# Altium schematic sheet Sheet1.SchDoc
size A2; SheetNumber: 1; SheetTotal: 1
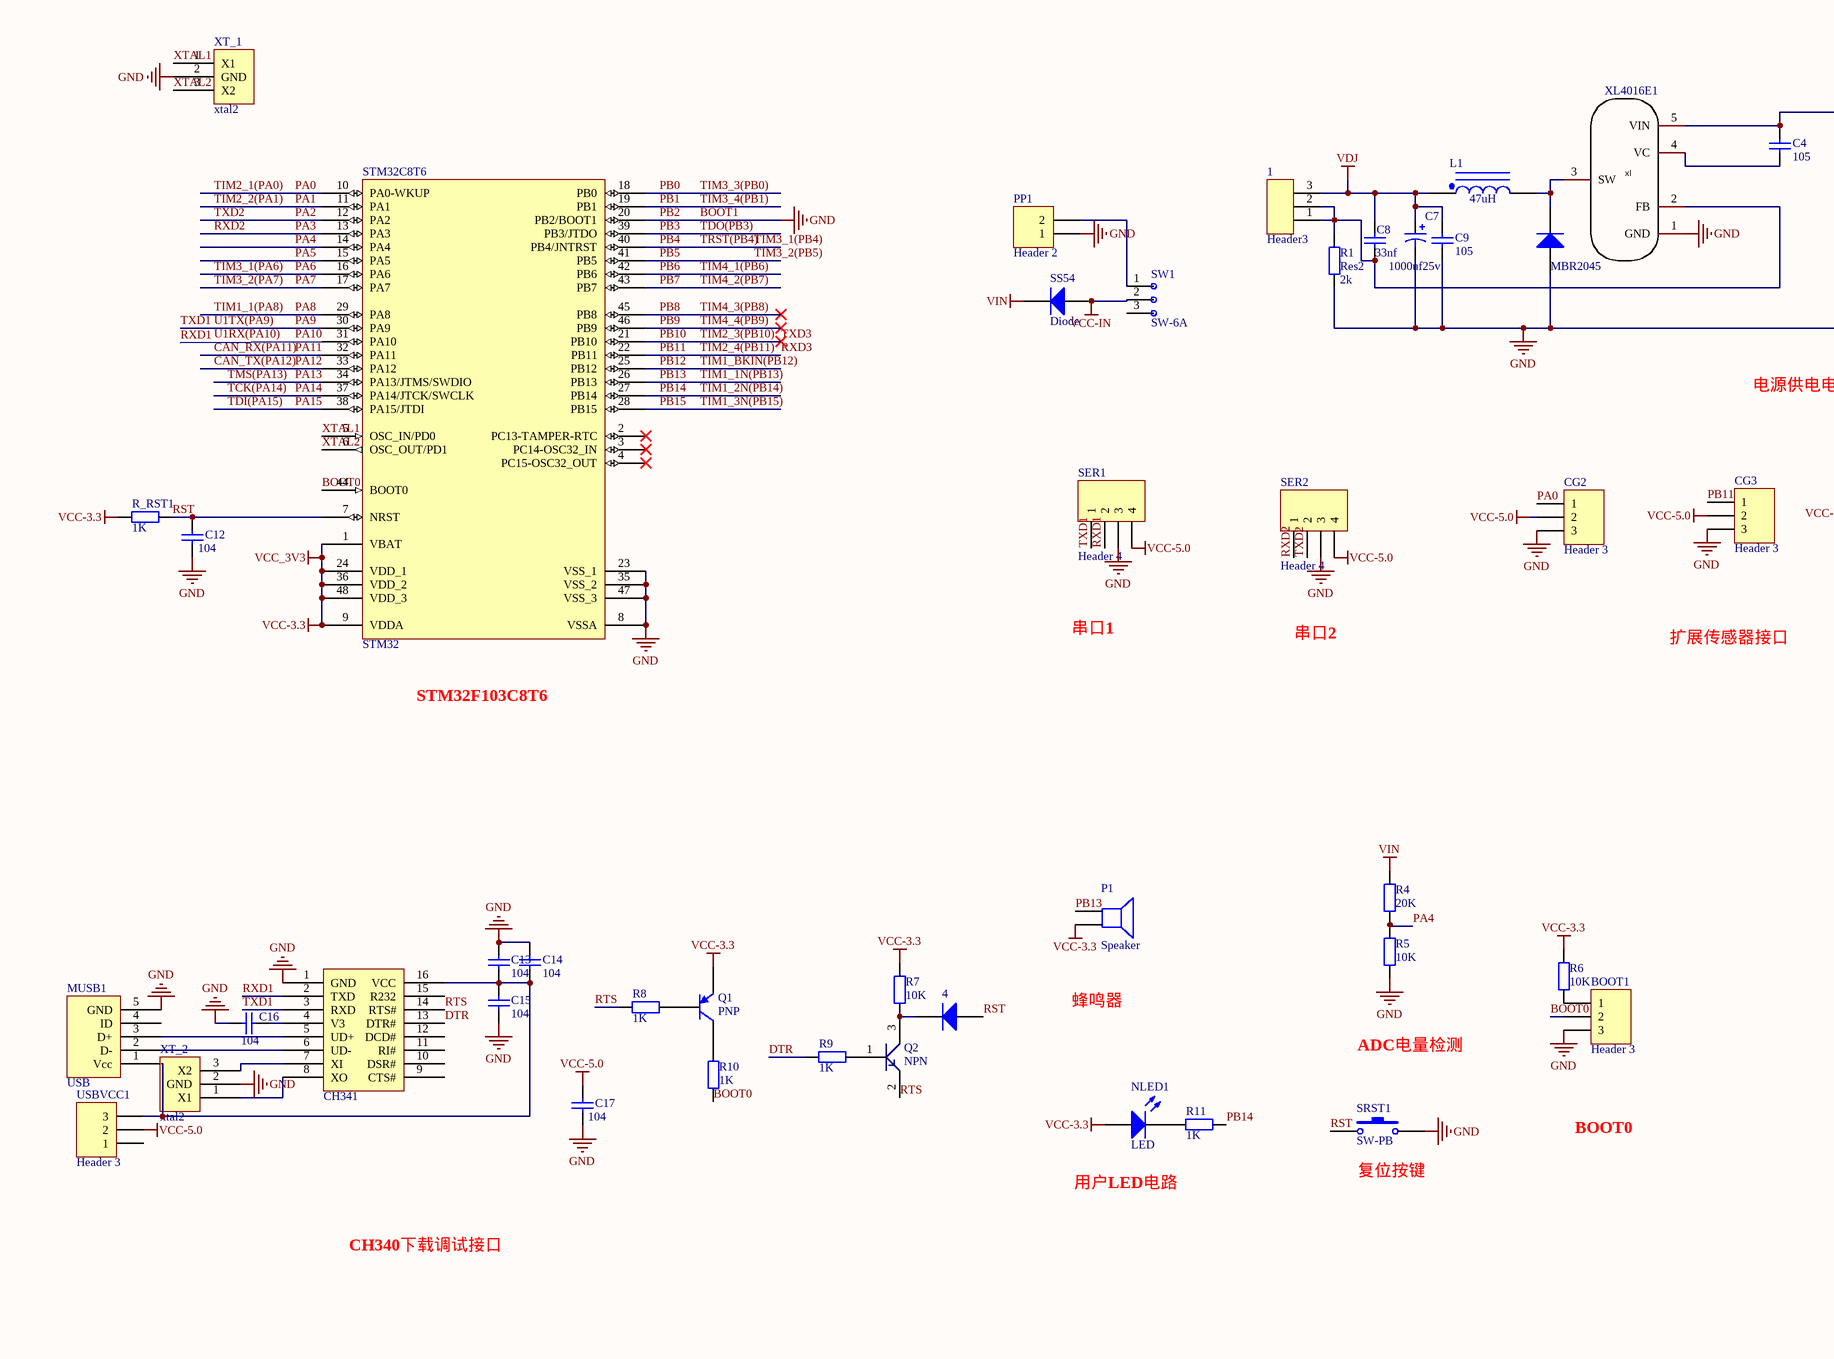
[diagram p0: Sheet1.SchDoc, left]
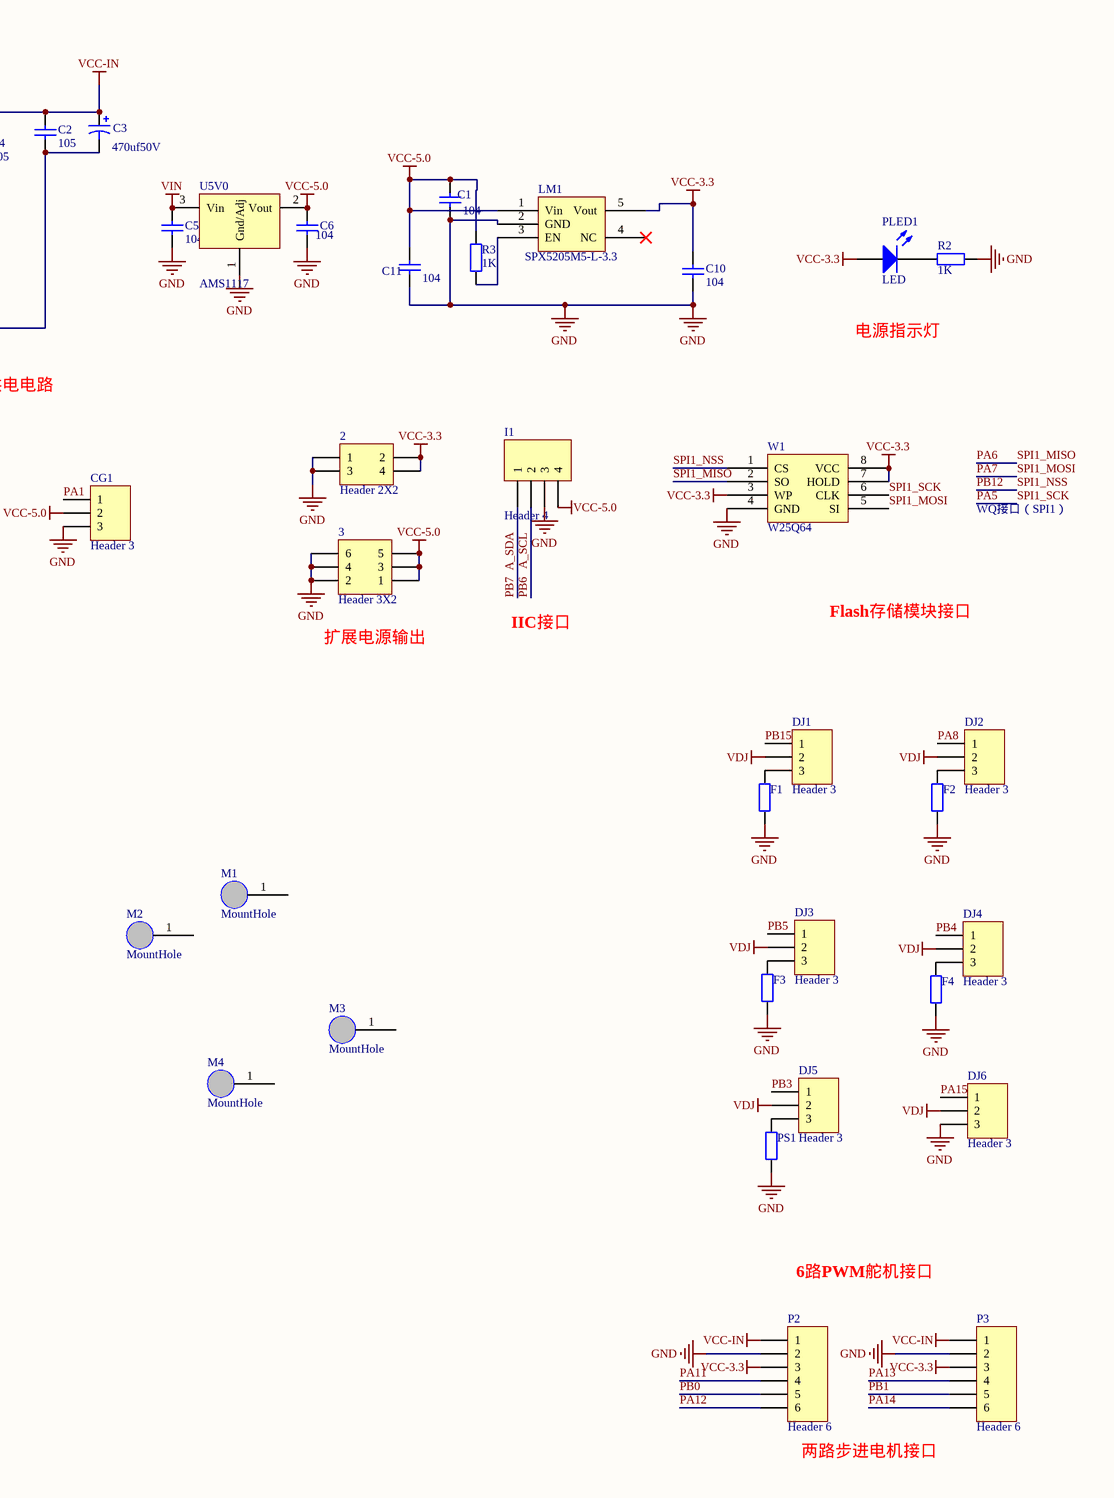
[diagram p1: Sheet1.SchDoc, right]

## Parts
1  Header3  [pot（长方形）]
2  Header 2X2  [HDR2X2]
3  Header 3X2  [HDR2X3]
4  Diode 1N4007  [0805L]  (value not drawn)
BOOT1  Header 3  [HDR1X3]
C1  value 104  [0603C]  (hidden comment: Cap)
C2  value 105  [0603C]  (hidden comment: Cap)
C3  value 470uf50V  [CAP_10_TIE]  (hidden comment: Cap Pol1)
C4  value 105  [0603C]  (hidden comment: Cap)
C5  value 104  [0603C]  (hidden comment: Cap)
C6  value 104  [0603C]  (hidden comment: Cap)
C7  1000uf25v  [cap_6.3_tie]
C8  value 33nf  [0603C]  (hidden comment: Cap)
C9  value 105  [0603C]  (hidden comment: Cap)
C10  value 104  [0603C]  (hidden comment: Cap)
C11  value 104  [0603C]  (hidden comment: Cap)
C12  value 104  [0603C]  (hidden comment: Cap)
C13  value 104  [0603C]  (hidden comment: Cap)
C14  value 104  [0603C]  (hidden comment: Cap)
C15  value 104  [0603C]  (hidden comment: Cap)
C16  value 104  [0603C]  (hidden comment: Cap)
C17  value 104  [0603C]  (hidden comment: Cap)
CG1  Header 3  [HDR1X3]
CG2  Header 3  [HDR1X3]
CG3  Header 3  [HDR1X3]
CH1  CH341  [SOP16]
DJ1  Header 3  [HDR1X3]
DJ2  Header 3  [HDR1X3]
DJ3  Header 3  [HDR1X3]
DJ4  Header 3  [HDR1X3]
DJ5  Header 3  [HDR1X3]
DJ6  Header 3  [HDR1X3]
F1  Res2  [0805R]  (value not drawn)
F2  Res2  [0805R]  (value not drawn)
F3  Res2  [0805R]  (value not drawn)
F4  Res2  [0805R]  (value not drawn)
I1  Header 4  [HDR1X4]
L1  value 47uH  [L_8x15]  (hidden comment: Inductor Iron Dot)
LM1  SPX5205M5-L-3.3  [spx520]
M1  MountHole  [M3-MountSlot]  (no BOM)
M2  MountHole  [M3-MountSlot]  (no BOM)
M3  MountHole  [M3-MountSlot]  (no BOM)
M4  MountHole  [M3-MountSlot]  (no BOM)
MBR2045  Diode 1N4007  [SS54]  (value not drawn)
MUSB1  USB  [microMINIusb 2]
NLED1  LED  [0603L]
P1  Speaker  [beep_9mm]
P2  Header 6  [HDR1X6]
P3  Header 6  [HDR1X6]
PLED1  LED  [0603L]
PP1  Header 2  [接线柱_2]
PS1  Res2  [0805R]  (value not drawn)
Q1  PNP  [sot-23]
Q2  NPN  [sot-23]
R1  Res2  value 2k  [0603R]
R2  value 1K  [0603R]  (hidden comment: Res2)
R3  value 1K  [0603R]  (hidden comment: Res2)
R4  value 20K  [0603R]  (hidden comment: Res2)
R5  value 10K  [0603R]  (hidden comment: Res2)
R6  value 10K  [0603R]  (hidden comment: Res2)
R7  value 10K  [0603R]  (hidden comment: Res2)
R8  value 1K  [0603R]  (hidden comment: Res2)
R9  value 1K  [0603R]  (hidden comment: Res2)
R10  value 1K  [0603R]  (hidden comment: Res2)
R11  value 1K  [0603R]  (hidden comment: Res2)
R_RST1  value 1K  [0603R]  (hidden comment: Res2)
SER1  Header 4  [HDR1X4]
SER2  Header 4  [HDR1X4]
SRST1  SW-PB  [miniBUTTON]
SS54  Diode  [贴片_4007]
STM32C8T6  STM32  [LQFP48]
SW1  SW-6A  [SW-6A]
U5V0  AMS1117  [sot-223]
USBVCC1  Header 3  [HDR1X3]
W1  W25Q64  [sop8 - kuan]
xl  XL4016E1  [PCBComponent_1]
XT_1  xtal2  [XTAL_3213]
XT_2  xtal2  [XTAL_3213]

## Nets
BOOT1: 2.1 2.3 3.2 3.4 3.6 BOOT1.3 C1.1 C2.2 C3.2 C5.1 C6.1 C7.2 C9.2 C10.1 C11.1 C12.1 C13.2 C14.2 C15.2 C16.2 C17.1 CG1.3 CG2.3 CG3.3 CH1.1(GND) DJ6.3 F1.1 F2.1 F3.1 F4.1 I1.3 LM1.2(GND) MBR2045.1(A) MUSB1.5(GND) P2.2 P3.2 PP1.1 PS1.1 R1.2 R2.1 R5.2 SER1.3 SER2.3 SRST1.2 STM32C8T6.8(VSSA) STM32C8T6.20(PB2/BOOT1) STM32C8T6.23(VSS_1) STM32C8T6.35(VSS_2) STM32C8T6.47(VSS_3) U5V0.1(Gnd/Adj) W1.4(GND) xl.1(GND) XT_1.2(GND) XT_2.2(GND)  [also labelled GND, PB2]
VCC-3.3: 2.2 2.4 C10.2 LM1.5(Vout) NLED1.1(A) P1.2 P2.3 P3.3 PLED1.1(A) Q1.2(E) R6.1 R7.1 R_RST1.1 STM32C8T6.1(VBAT) STM32C8T6.9(VDDA) STM32C8T6.24(VDD_1) STM32C8T6.36(VDD_2) STM32C8T6.48(VDD_3) W1.3(WP) W1.7(HOLD) W1.8(VCC)  [also labelled VCC_3V3]
VCC-5.0: 3.1 3.3 3.5 C1.2 C6.2 C11.2 C17.2 CG1.2 CG2.2 CG3.2 I1.4 LM1.1(Vin) R3.1 SER1.4 SER2.4 U5V0.2(Vout) USBVCC1.2
VCC-IN: C2.1 C3.1 C4.1 P2.1 P3.1 SS54.1(A) SW1.2 xl.5(VIN)
VDJ: 1.3 C7.1 C8.1 C9.1 DJ1.2 DJ2.2 DJ3.2 DJ4.2 DJ5.2 DJ6.2 L1.1
VIN: C5.2 R4.1 SS54.2(K) U5V0.3(Vin)
A_SCL: I1.2 STM32C8T6.42(PB6)  [also labelled PB6, TIM4_1(PB6)]
A_SDA: I1.1 STM32C8T6.43(PB7)  [also labelled PB7, TIM4_2(PB7)]
BOOT0: BOOT1.2 R10.1 STM32C8T6.44(BOOT0)
CAN_RX(PA11): P2.4 STM32C8T6.32(PA11)  [also labelled PA11]
CAN_TX(PA12): P2.6 STM32C8T6.33(PA12)  [also labelled PA12]
DTR: CH1.13(DTR#) R9.2
PA0: CG2.1 STM32C8T6.10(PA0-WKUP)  [also labelled TIM2_1(PA0)]
PA1: CG1.1 STM32C8T6.11(PA1)  [also labelled TIM2_2(PA1)]
PA2: SER2.2 STM32C8T6.12(PA2)  [also labelled TXD2]
PA3: SER2.1 STM32C8T6.13(PA3)  [also labelled RXD2]
PA4: R4.2 R5.1 STM32C8T6.14(PA4)
PA5: STM32C8T6.15(PA5) W1.6(CLK)  [also labelled SPI1_SCK]
PA6: STM32C8T6.16(PA6) W1.2(SO)  [also labelled SPI1_MISO, TIM3_1(PA6)]
PA7: STM32C8T6.17(PA7) W1.5(SI)  [also labelled SPI1_MOSI, TIM3_2(PA7)]
PA8: DJ2.1 STM32C8T6.29(PA8)  [also labelled TIM1_1(PA8)]
PA9: CH1.3(RXD) SER1.1 STM32C8T6.30(PA9)  [also labelled TXD1, U1TX(PA9)]
PA13: P3.4 STM32C8T6.34(PA13/JTMS/SWDIO)  [also labelled TMS(PA13)]
PA14: P3.6 STM32C8T6.37(PA14/JTCK/SWCLK)  [also labelled TCK(PA14)]
PA15: DJ6.1 STM32C8T6.38(PA15/JTDI)  [also labelled TDI(PA15)]
PB0: P2.5 STM32C8T6.18(PB0)  [also labelled TIM3_3(PB0)]
PB1: P3.5 STM32C8T6.19(PB1)  [also labelled TIM3_4(PB1)]
PB3: DJ5.1 STM32C8T6.39(PB3/JTDO)  [also labelled TDO(PB3)]
PB4: DJ4.1 STM32C8T6.40(PB4/JNTRST)  [also labelled ~{TRST}(PB4), TIM3_1(PB4)]
PB5: DJ3.1 STM32C8T6.41(PB5)  [also labelled TIM3_2(PB5)]
PB8: STM32C8T6.45(PB8)  [also labelled TIM4_3(PB8)]
PB9: STM32C8T6.46(PB9)  [also labelled TIM4_4(PB9)]
PB10: STM32C8T6.21(PB10)  [also labelled TIM2_3(PB10), TXD3]
PB11: CG3.1 STM32C8T6.22(PB11)  [also labelled RXD3, TIM2_4(PB11)]
PB12: STM32C8T6.25(PB12) W1.1(CS)  [also labelled SPI1_NSS, TIM1_BKIN(PB12)]
PB13: P1.1 STM32C8T6.26(PB13)  [also labelled TIM1_1N(PB13)]
PB14: R11.1 STM32C8T6.27(PB14)  [also labelled TIM1_2N(PB14)]
PB15: DJ1.1 STM32C8T6.28(PB15)  [also labelled TIM1_3N(PB15)]
RST: 4.1(A) C12.2 R_RST1.2 SRST1.1 STM32C8T6.7(NRST)
RTS: CH1.14(RTS#) Q2.2 R8.1
RXD1: CH1.2(TXD) SER1.2 STM32C8T6.31(PA10)
XTAL1: STM32C8T6.5(OSC_IN/PD0) XT_1.1(X1)
XTAL2: STM32C8T6.6(OSC_OUT/PD1) XT_1.3(X2)
Net1_1: 1.1 1.2 C8.2 R1.1 xl.2(FB)
Net4_2: 4.2(K) Q2.3 R7.2
NetBOOT1_1: BOOT1.1 R6.2
NetC4_2: C4.2 xl.4(VC)
NetC13_1: C13.1 C14.1 C15.1 CH1.16(VCC) MUSB1.1(Vcc) USBVCC1.3
NetC16_1: C16.1 CH1.4(V3)
NetCH1_5: CH1.5(UD+) MUSB1.3(D+)
NetCH1_6: CH1.6(UD-) MUSB1.2(D-)
NetCH1_7: CH1.7(XI) XT_2.3(X2)
NetCH1_8: CH1.8(XO) XT_2.1(X1)
NetDJ1_3: DJ1.3 F1.2
NetDJ2_3: DJ2.3 F2.2
NetDJ3_3: DJ3.3 F3.2
NetDJ4_3: DJ4.3 F4.2
NetDJ5_3: DJ5.3 PS1.2
NetL1_2: L1.2 MBR2045.2(K) xl.3(SW)
NetLM1_3: LM1.3(EN) R3.2
NetNLED1_2: NLED1.2(K) R11.2
NetPLED1_2: PLED1.2(K) R2.2
NetPP1_2: PP1.2 SW1.1
NetQ1_1: Q1.1(B) R8.2
NetQ1_3: Q1.3(C) R10.2
NetQ2_1: Q2.1 R9.1

Not connected (* = marked no-connect by the designer): CH1 9(CTS#) 10(DSR#) 11(RI#) 12(DCD#) 15(R232); LM1 4(NC)*; M1 1; M2 1; M3 1; M4 1; MUSB1 4(ID); STM32C8T6 2(PC13-TAMPER-RTC)* 3(PC14-OSC32_IN)* 4(PC15-OSC32_OUT)*; SW1 3; USBVCC1 1

## Notes on the sheet
- 电源指示灯
- 电源供电电路
- WQ接口（SPI1）
- 串口1
- 串口2
- IIC接口
- Flash存储模块接口
- STM32F103C8T6
- 扩展传感器接口
- (near 3) 扩展电源输出
- 蜂鸣器
- ADC电量检测
- (near SRST1) 复位按键
- BOOT0
- 用户LED电路
- CH340下载调试接口
- 6路PWM舵机接口
- (near P2) 两路步进电机接口
- Labels drawn without touching a wire or pin: PA10, U1RX(PA10)

## Library data of the parts
2 = Header 2X2: Header, 2-Pin, Dual row; LatestRevisionDate: 17-Jul-2002; LatestRevisionNote: Re-released for DXP Platform.; Publisher: Altium Limited
3 = Header 3X2: Header, 3-Pin, Dual row; LatestRevisionDate: 17-Jul-2002; LatestRevisionNote: Re-released for DXP Platform.; Publisher: Altium Limited
4 MBR2045 = Diode 1N4007: 1 Amp General Purpose Rectifier; Published: 8-Jun-2000; LatestRevisionDate: 17-Jul-2002; LatestRevisionNote: Re-released for DXP Platform.; DatasheetDocument: 1998; PackageDocument: Aug-1999; PackageReference: DO-41; Publisher: Altium Limited; Code_JEDEC: DO-204-AL; ComponentLink1Description: Manufacturer Link; ComponentLink1URL: http://www.fairchildsemi.com/; ComponentLink2Description: Datasheet; ComponentLink2URL: http://www.fairchildsemi.com/ds/1N%2F1N4001.pdf
BOOT1 CG1-CG3 DJ1-DJ6 USBVCC1 = Header 3: Header, 3-Pin; LatestRevisionDate: 17-Jul-2002; LatestRevisionNote: Re-released for DXP Platform.; Publisher: Altium Limited
C1 C2 C4-C6 C8-C17 = Cap: Capacitor; Published: 8-Jun-2000; LatestRevisionDate: 17-Jul-2002; LatestRevisionNote: Re-released for DXP Platform.; PackageReference: RAD-0.3; Publisher: Altium Limited
C3 = Cap Pol1: Polarized Capacitor (Radial); Published: 8-Jun-2000; LatestRevisionDate: 17-Jul-2002; LatestRevisionNote: Re-released for DXP Platform.; PackageReference: RB7.6-15; Publisher: Altium Limited
C7 = Cap_Pol
F1-F4 PS1 = Res2: Resistor; Value: 1K; Published: 8-Jun-2000; LatestRevisionDate: 17-Jul-2002; LatestRevisionNote: Re-released for DXP Platform.; PackageReference: AXIAL-0.4; Publisher: Altium Limited
I1 SER1 SER2 = Header 4: Header, 4-Pin; LatestRevisionDate: 17-Jul-2002; LatestRevisionNote: Re-released for DXP Platform.; Publisher: Altium Limited
L1 = Inductor Iron Dot: Magnetic-Core Inductor with Winding Polarity Marking; Published: 24-Mar-1999; LatestRevisionDate: 17-Jul-2002; LatestRevisionNote: Re-released for DXP Platform.; PackageReference: DIODE_SMC; Publisher: Altium Limited
LM1 = SPX5205M5-L-5-0
M1-M4 = MountHole: 固定孔
P1 = Speaker: Loudspeaker; Published: 24-Mar-1999; LatestRevisionDate: 17-Jul-2002; LatestRevisionNote: Re-released for DXP Platform.; PackageReference: PIN2; Publisher: Altium Limited
P2 P3 = Header 6: Header, 6-Pin; LatestRevisionDate: 17-Jul-2002; LatestRevisionNote: Re-released for DXP Platform.; Publisher: Altium Limited
PP1 = Header 2: Header, 2-Pin; LatestRevisionDate: 17-Jul-2002; LatestRevisionNote: Re-released for DXP Platform.; Publisher: Altium Limited
R1-R11 R_RST1 = Res2: Resistor; Published: 8-Jun-2000; LatestRevisionDate: 17-Jul-2002; LatestRevisionNote: Re-released for DXP Platform.; PackageReference: AXIAL-0.4; Publisher: Altium Limited
SS54 = Diode: Default Diode; Published: 8-Jun-2000; LatestRevisionDate: 17-Jul-2002; LatestRevisionNote: Re-released for DXP Platform.; PackageDocument: Sep-1996; PackageReference: SMC; Publisher: Altium Limited; Code_JEDEC: DO-214-AB
STM32C8T6 = STM32F103C8T6
xl = XL4016E1: Manufacturer: XLSEMI(芯龙); Add into BOM: yes; Function: 降压型; Synchronous Rectification: 否; Number of Outputs: 1; Topology: 降压式; Input Voltage: 8V~40V; Output Voltage: 1.25V~36V; Output Current (Max): 8A; Switching Frequency: 180kHz; Name: XL4016E1; Symbol: XL4016E1; Device: XL4016E1; LCSC Part Name: 降压型 Vin=8V~40V Vout=1.25V~36V 8A; Supplier Part: C55881; Manufacturer Part: XL4016E1; Supplier Footprint: TO-220-5; JLCPCB Part Class: Extended Part; Datasheet: https://atta.szlcsc.com/upload/public/pdf/source/20221017/BA256A5392B705775B4C335FAFB3EDCF.pdf; Supplier: LCSC; Convert to PCB: yes